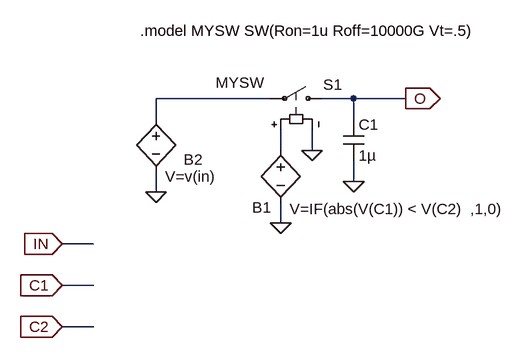
[diagram p0: schematic Sampler.asc]
Sampler.asc, the LTspice schematic file:
Version 4
SHEET 1 880 680
WIRE 336 -144 160 -144
WIRE 464 -144 416 -144
WIRE 544 -144 464 -144
WIRE 160 -112 160 -144
WIRE 464 -112 464 -144
WIRE 352 -64 352 -96
WIRE 400 -64 400 -96
WIRE 464 -16 464 -48
WIRE 160 0 160 -32
WIRE 352 48 352 16
WIRE 64 80 16 80
WIRE 64 144 16 144
WIRE 64 208 16 208
FLAG 16 80 IN
IOPIN 16 80 In
FLAG 16 144 C1
IOPIN 16 144 In
FLAG 16 208 C2
IOPIN 16 208 In
FLAG 352 48 0
FLAG 544 -144 O
IOPIN 544 -144 Out
FLAG 464 -16 0
FLAG 160 0 0
FLAG 400 -64 0
SYMBOL bv 352 -80 R0
WINDOW 3 14 106 Left 2
WINDOW 0 -44 104 Left 2
SYMATTR Value V=IF(abs(V(C1)) < V(C2)  ,1,0)
SYMATTR InstName B1
SYMBOL bv 160 -128 R0
WINDOW 3 14 104 Left 2
WINDOW 0 43 78 Left 2
SYMATTR Value V=v(in)
SYMATTR InstName B2
SYMBOL cap 448 -112 R0
SYMATTR InstName C1
SYMATTR Value 1µ
SYMBOL sw 432 -144 M270
WINDOW 0 21 15 VLeft 2
WINDOW 3 24 106 VRight 2
SYMATTR InstName S1
SYMATTR Value MYSW
TEXT 136 -248 Left 2 !.model MYSW SW(Ron=1u Roff=10000G Vt=.5)

The netlist it stands for:
* Sampler.asc
B1 N002 0 V=IF(abs(V(C1)) < V(C2)  ,1,0)
B2 N001 0 V=v(in)
C1 O 0 1µ
S1 O N001 N002 0 MYSW
.model MYSW SW(Ron=1u Roff=10000G Vt=.5)
.backanno
.end